# Altium schematic sheet 电源.SchDoc
size A4
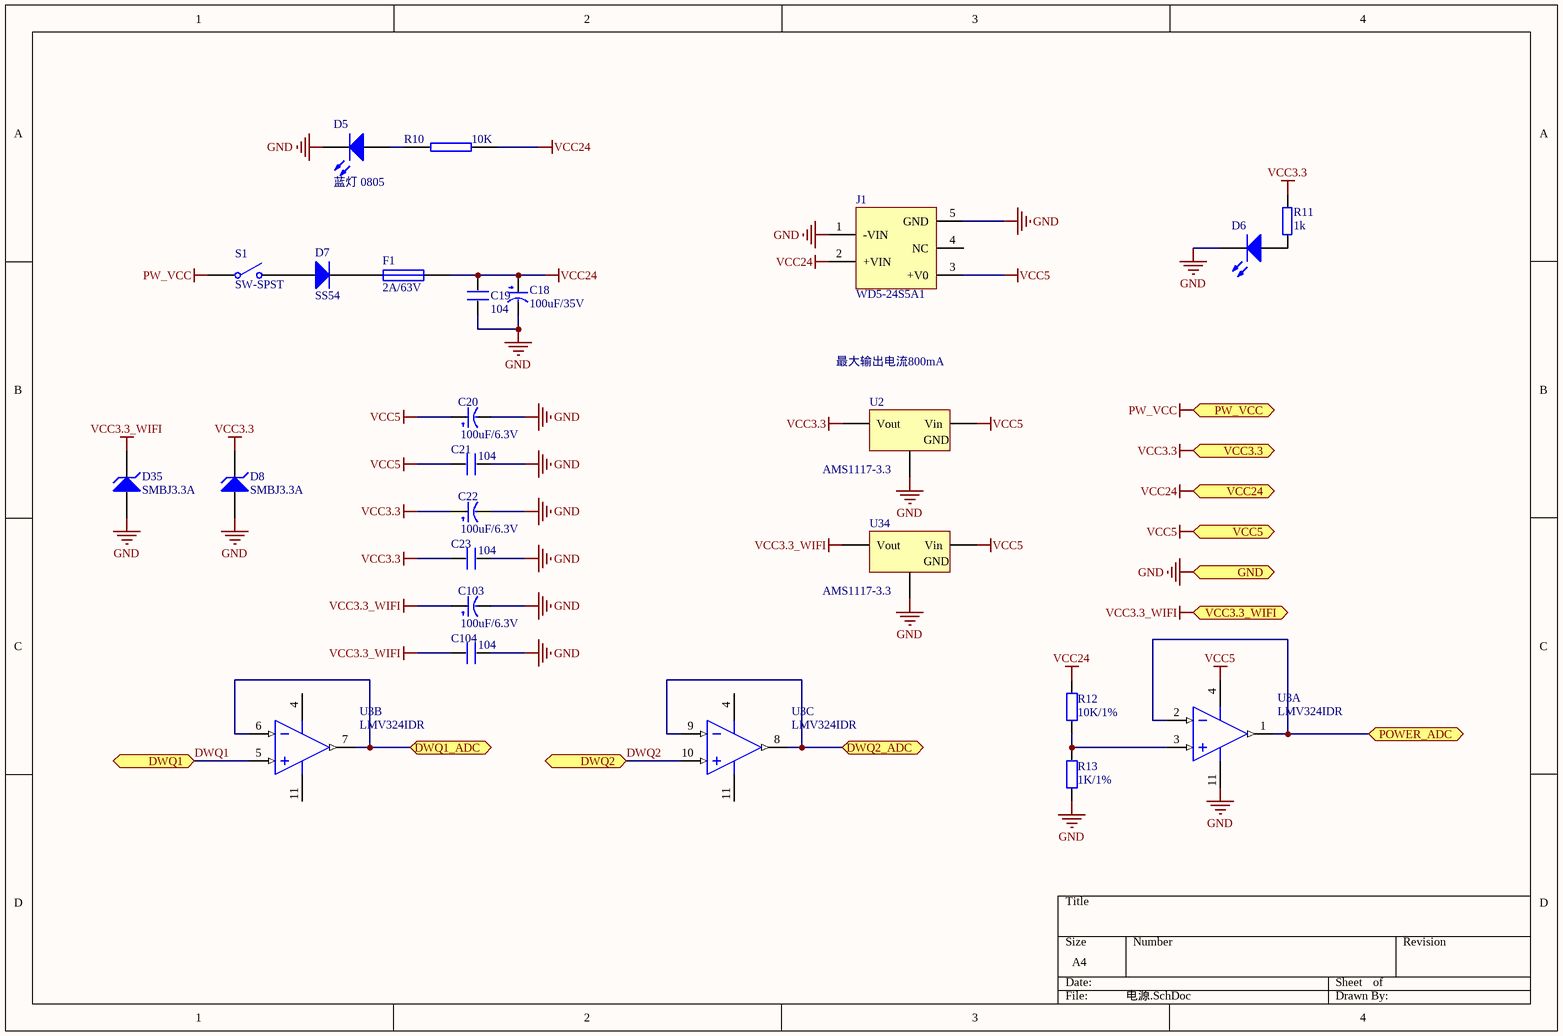
[diagram p0: 电源.SchDoc]

## Parts
C18  100uF/35V  [CC6.56.5]
C19  104  [0805_C]
C20  100uF/6.3V  [CASE-B_3528]
C21  104  [0805_C]
C22  100uF/6.3V  [CASE-B_3528]
C23  104  [0805_C]
C103  100uF/6.3V  [CASE-B_3528]
C104  104  [0805_C]
D5  蓝灯 0805  [0805_LED_S1]
D6  蓝灯 0805  [LC-0805_LED_S1]  (value not drawn)
D7  SS54  [SMA(DO-214AC)_S1]
D8  SMBJ3.3A  [SMB(DO-214AA)_S1]
D35  SMBJ3.3A  [SMB(DO-214AA)_S1]
F1  2A/63V  [1206]
J1  WD5-24S5A1  [WD5-24S3V3]
R10  10K  [0603_R]
R11  1k  [0805_R]
R12  10K/1%  [0805_R]
R13  1K/1%  [0805_R]
S1  SW-SPST  [SPST-2]
U2  AMS1117-3.3  [SOT-223]
U3  LMV324IDR  [SOIC-14_150mil]  (parts A,B,C of 4)
U34  AMS1117-3.3  [SOT-223]

## Ports
DWQ1, DWQ1_ADC, DWQ2, DWQ2_ADC, GND, POWER_ADC, PW_VCC, VCC3.3, VCC3.3_WIFI, VCC5, VCC24

## Nets
GND: C18.2(GND) C19.2 C20.2(GND) C21.1 C22.2(GND) C23.1 C103.2(GND) C104.1 D5.K D6.K D8.1(A) D35.1(A) J1.1(-VIN) J1.5(GND) R13.1 U2.1(GND) U3.11(V-) U34.1(GND) ; port GND
PW_VCC: S1.1(COMMON) ; port PW_VCC
VCC3.3: C22.1(VCC) C23.2 D8.2(K) R11.1 U2.2(Vout) ; port VCC3.3
VCC3.3_WIFI: C103.1(VCC) C104.2 D35.2(K) U34.2(Vout) ; port VCC3.3_WIFI
VCC5: C20.1(VCC) C21.2 J1.3(+V0) U2.3(Vin) U3.4(V+) U34.3(Vin) ; port VCC5
VCC24: C18.1(VCC) C19.1 F1.2 J1.2(+VIN) R10.1 R12.2 ; port VCC24
DWQ1: U3.5(INB+) ; port DWQ1
DWQ1_ADC: U3.6(INB-) U3.7(OUTB) ; port DWQ1_ADC
DWQ2: U3.10(INC+) ; port DWQ2
DWQ2_ADC: U3.8(OUTC) U3.9(INC-) ; port DWQ2_ADC
POWER_ADC: U3.1(OUTA) U3.2(INA-) ; port POWER_ADC
NetD5_A: D5.A R10.2
NetD6_A: D6.A R11.2
NetD7_1: D7.1(A) S1.2(NO)
NetD7_2: D7.2(K) F1.1
NetR12_1: R12.1 R13.2 U3.3(INA+)

Not connected (* = marked no-connect by the designer): J1 4(NC)

## Notes on the sheet
- 最大输出电流800mA

## Library data of the parts
C18 C20 C22 C103 = CAP
C19 C21 C23 C104 = C
D5 = 0805 蓝灯: 发光二极管; ComponentLink1Description: 供应商链接; ComponentLink1URL: http://www.szlcsc.com/product/details_2666.html; Package: 0805; Supplier: LC; SuppliersPartNumber: C2293
D6 = LED0: Typical INFRARED GaAs LED; Published: 8-Jun-2000; LatestRevisionDate: 08-Jul-2005; LatestRevisionNote: Mech Layer 1 removed.; PackageReference: LED-0; Publisher: Altium Limited; PackageDescription: LED; 2 Leads
D7 = SMA(DO-214AC) SS54: 二极管; ComponentLink1Description: 供应商链接; ComponentLink1URL: http://www.szlcsc.com/product/details_23178.html; Package: SMA(DO-214AC); Supplier: LC; SuppliersPartNumber: C22452
D8 D35 = D Zener: Zener Diode; Published: 8-Jun-2000; LatestRevisionDate: 17-Jul-2002; LatestRevisionNote: Re-released for DXP Platform.; PackageReference: DIODE-0.7; Publisher: Altium Limited; PackageDescription: Diode, Thru-Hole; 2 Leads; 0.7 in Pin Spacing
F1 = Fuse 1: Fuse; Published: 8-Jun-2000; LatestRevisionDate: 17-Jul-2002; LatestRevisionNote: Re-released for DXP Platform.; PackageReference: PIN-W2/E2.8; Publisher: Altium Limited; PackageDescription: Thru-Hole; 2 Leads
J1 = WD5-24S3V3A1
R10 = RES2
R11 = R_2
R12 = Res2: Resistor; Value: 10K; Published: 8-Jun-2000; LatestRevisionDate: 17-Jul-2002; LatestRevisionNote: Re-released for DXP Platform.; PackageReference: AXIAL-0.4; Publisher: Altium Limited; PackageDescription: Axial Device, Thru-Hole; 2 Leads; 0.4 in Pin Spacing
R13 = Res2: Resistor; Value: 1K; Published: 8-Jun-2000; LatestRevisionDate: 17-Jul-2002; LatestRevisionNote: Re-released for DXP Platform.; PackageReference: AXIAL-0.4; Publisher: Altium Limited; PackageDescription: Axial Device, Thru-Hole; 2 Leads; 0.4 in Pin Spacing
S1 = SW-SPST: Single-Pole, Single-Throw Switch; Published: 24-Mar-1999; LatestRevisionDate: 17-Jul-2002; LatestRevisionNote: Re-released for DXP Platform.; PackageReference: SPST-2; Publisher: Altium Limited; PackageDescription: Switch; 2 Leads
U2 U34 = SOT-223 AMS1117-3.3: 低压差线性稳压(LDO); ComponentLink1Description: 供应商链接; ComponentLink1URL: http://www.szlcsc.com/product/details_6652.html; Package: SOT-223; Supplier: LC; SuppliersPartNumber: C6186
U3 = LMV324IDR: 运放; ComponentLink1Description: 供应商链接; ComponentLink1URL: http://www.szlcsc.com/product/details_8451.html; Package: SOIC-14_150mil; Supplier: LC; SuppliersPartNumber: C7974